# EAGLE schematic BareBonesArduino (EAGLE 6.5.0)
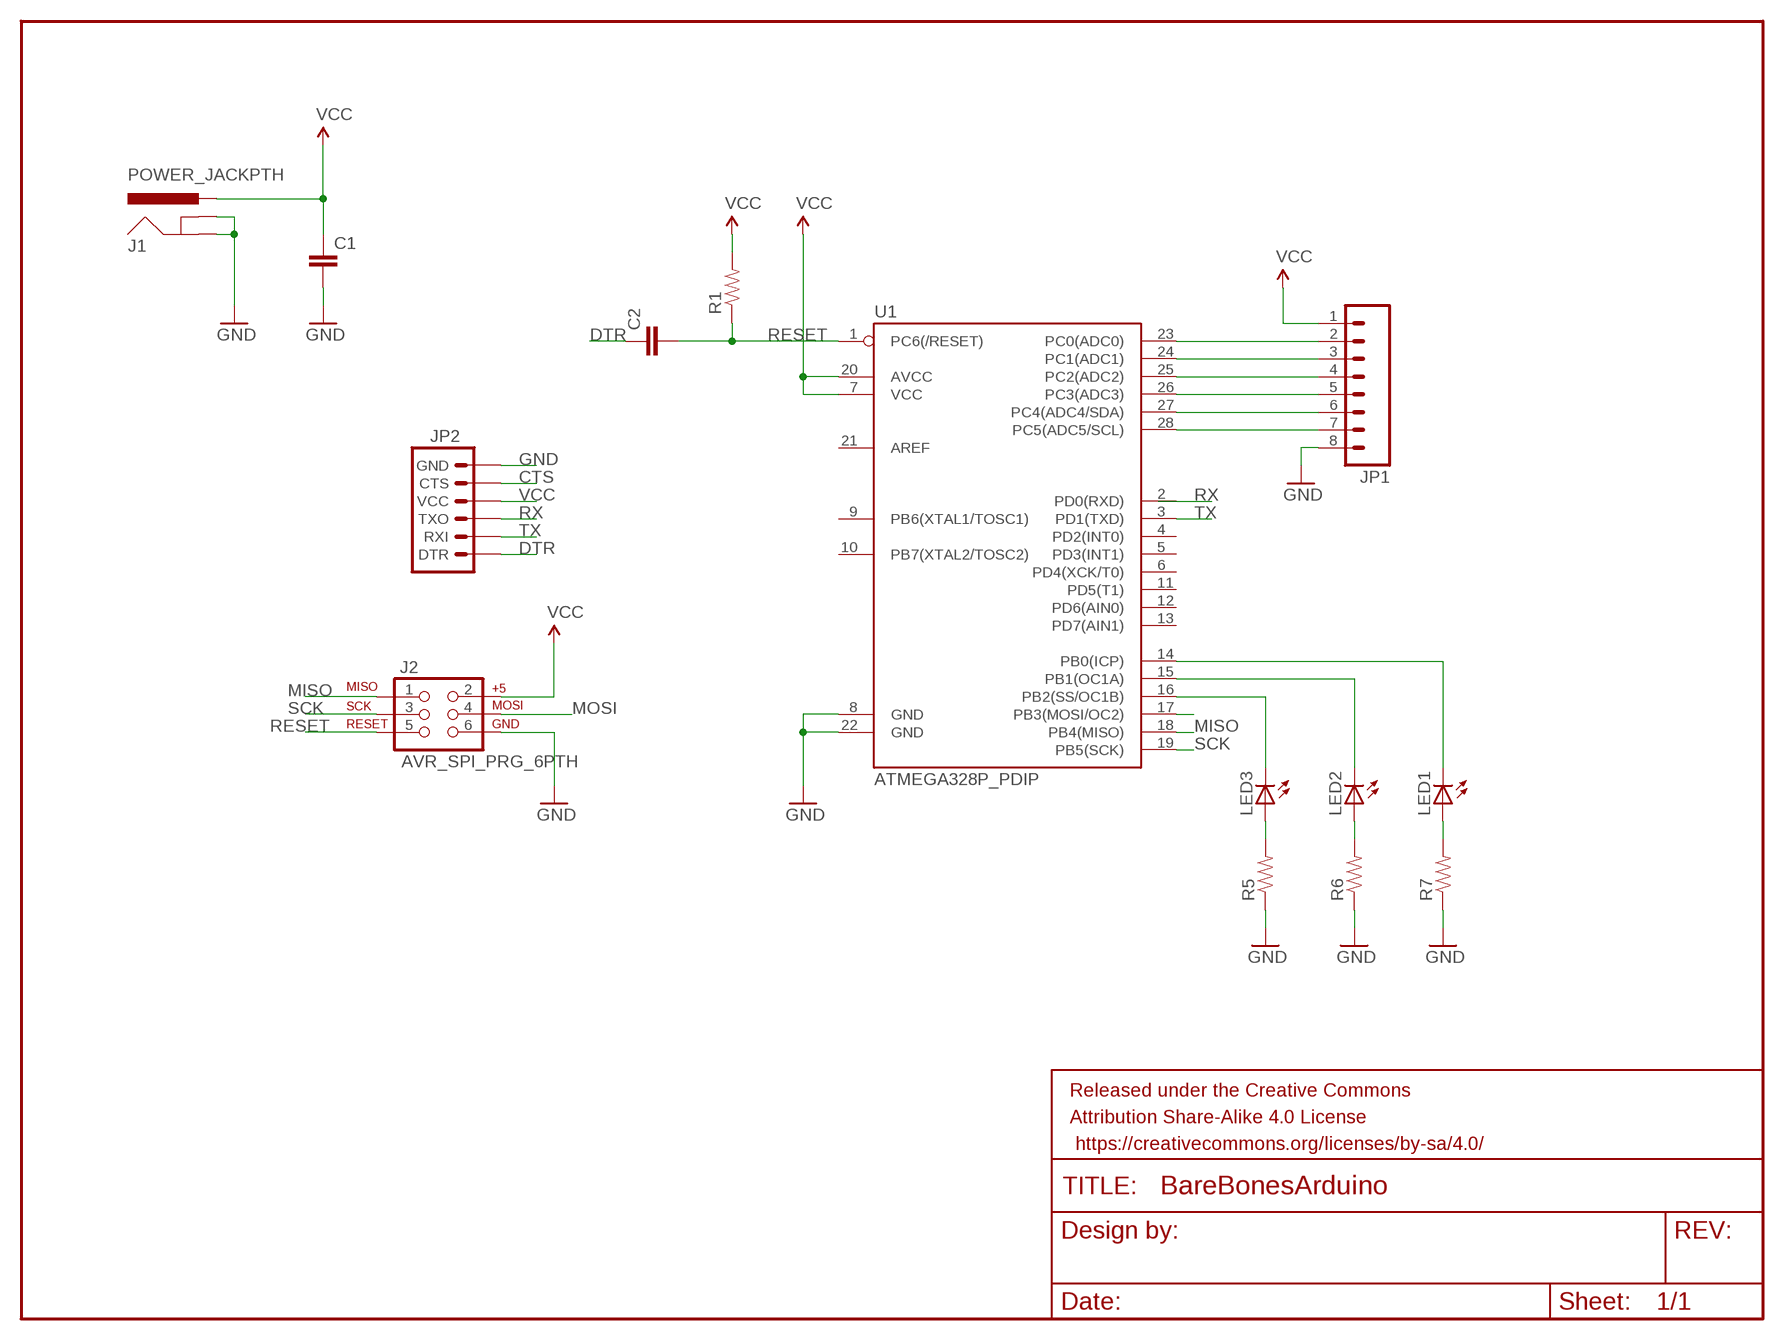
[diagram p0: schematic, sheet 1]

## Parts
C1  CAPPTH  [CAP-PTH-SMALL]
C2  CAPPTH  [CAP-PTH-SMALL]
FRAME1  FRAME-LETTER  [CREATIVE_COMMONS]
J1  POWER_JACKPTH  [POWER_JACK_PTH]
J2  AVR_SPI_PRG_6PTH  [2X3]
JP1  M081X08  [1X08]
JP2  ARDUINO_SERIAL_PROGRAMPTH  [1X06]
LED1  LED5MM  [LED5MM]
LED2  LED5MM  [LED5MM]
LED3  LED5MM  [LED5MM]
R1  RESISTORPTH-1/4W  [AXIAL-0.4]
R5  RESISTORPTH-1/4W  [AXIAL-0.4]
R6  RESISTORPTH-1/4W  [AXIAL-0.4]
R7  RESISTORPTH-1/4W  [AXIAL-0.4]
U1  ATMEGA328P_PDIP  [DIL28-3]

## Nets
CTS: JP2.5(CTS)
DTR: C2.1 JP2.1(DTR)
GND: C1.2 J1.GND J1.GNDBREAK J2.6 JP1.8 JP2.6(GND) R5.P$1 R6.P$1 R7.P$1 U1.8(GND) U1.22(GND)
MISO: J2.1 U1.18(PB4(MISO))
MOSI: J2.4 LED3.K(C) U1.16(PB2(SS/OC1B)) U1.17(PB3(MOSI/OC2))
N$1: JP1.4 U1.25(PC2(ADC2))
N$2: LED2.A R6.P$2
N$5: JP1.2 U1.23(PC0(ADC0))
N$6: JP1.3 U1.24(PC1(ADC1))
N$8: JP1.5 U1.26(PC3(ADC3))
N$9: JP1.7 U1.28(PC5(ADC5/SCL))
N$10: JP1.6 U1.27(PC4(ADC4/SDA))
N$12: LED2.K(C) U1.15(PB1(OC1A))
N$13: LED1.K(C) U1.14(PB0(ICP))
N$14: LED3.A R5.P$2
N$16: LED1.A R7.P$2
RESET: C2.2 J2.5 R1.P$1 U1.1(PC6(/RESET))
RX: JP2.3(TXO)
SCK: J2.3 U1.19(PB5(SCK))
TX: JP2.2(RXI) U1.3(PD1(TXD))
VCC: C1.1 J1.PWR J2.2 JP1.1 JP2.4(VCC) R1.P$2 U1.7(VCC) U1.20(AVCC)
Unconnected: U1.2(PD0(RXD)) U1.4(PD2(INT0)) U1.5(PD3(INT1)) U1.6(PD4(XCK/T0)) U1.9(PB6(XTAL1/TOSC1)) U1.10(PB7(XTAL2/TOSC2)) U1.11(PD5(T1)) U1.12(PD6(AIN0)) U1.13(PD7(AIN1)) U1.21(AREF)

## Library data of the parts
C1 C2 = SparkFun-Capacitors:CAP: Capacitor Standard 0603 ceramic capacitor, and 0.1" leaded capacitor.
FRAME1 = SparkFun-Aesthetics:FRAME-LETTER: Schematic Frame Standard 8.5x11 US Letter frame
J1 = SparkFun-Connectors:POWER_JACK: Power Jack This is the standard 5.5mm barrel jack for power. The PTH is the most common, proven, reliable, footprint. The Slot footprint only works if the mill layer is transmitted to the PCB fab house so be warned. Mating wall wart : TOL-00298 (and others); PROD_ID: PRT-00119
J2 = SparkFun-Connectors:AVR_SPI_PRG_6: AVR ISP 6 Pin This is the reduced ISP connector for AVR programming. Common on Arduino. This footprint will take up less PCB space and can be used with a 10-pin to 6-pin adapter such as SKU: BOB-08508
JP1 = SparkFun-Connectors:M08: Header 8 Standard 8-pin 0.1" header. Use with straight break away headers (SKU : PRT-00116), right angle break away headers (PRT-00553), swiss pins (PRT-00743), machine pins (PRT-00117), and female headers (PRT-00115).
JP2 = SparkFun-Connectors:ARDUINO_SERIAL_PROGRAM: FTDI connector footprints
LED1-LED3 = SparkFun-LED:LED: LEDs Standard schematic elements and footprints for 5mm, 3mm, 1206, and 0603 sized LEDs. 5mm - Spark Fun Electronics SKU : COM-00529 (and others)
R1 R5-R7 = SparkFun-Resistors:RESISTOR: Resistor Basic schematic elements and footprints for 0603, 1206, and PTH resistors.
U1 = SparkFun-DigitalIC:ATMEGA328P_PDIP: uC used in the Arduino 32kb flash, 1k EEPROM, 2k SRAM This is the through-hole version of this chip.